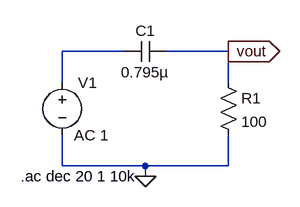
[diagram p0: schematic High Pass Filter Circuit.asc]
High Pass Filter Circuit.asc, the LTspice schematic file:
Version 4
SHEET 1 880 680
WIRE 384 240 288 240
WIRE 544 240 448 240
WIRE 288 288 288 240
WIRE 544 288 544 240
WIRE 288 416 288 368
WIRE 416 416 288 416
WIRE 544 416 544 368
WIRE 544 416 416 416
WIRE 416 432 416 416
FLAG 416 432 0
FLAG 544 240 vout
IOPIN 544 240 Out
SYMBOL voltage 288 272 R0
WINDOW 123 18 97 Left 2
WINDOW 39 0 0 Left 0
SYMATTR Value2 AC 1
SYMATTR InstName V1
SYMATTR Value ""
SYMBOL cap 448 224 R90
WINDOW 0 0 32 VBottom 2
WINDOW 3 32 32 VTop 2
SYMATTR InstName C1
SYMATTR Value 0.795µ
SYMBOL res 528 272 R0
SYMATTR InstName R1
SYMATTR Value 100
TEXT 224 432 Left 2 !.ac dec 20 1 10k

The netlist it stands for:
* High Pass Filter Circuit.asc
V1 N001 0 AC 1
C1 vout N001 0.795µ
R1 vout 0 100
.ac dec 20 1 10k
.backanno
.end